# EAGLE design Power only (EAGLE 8.6.3)
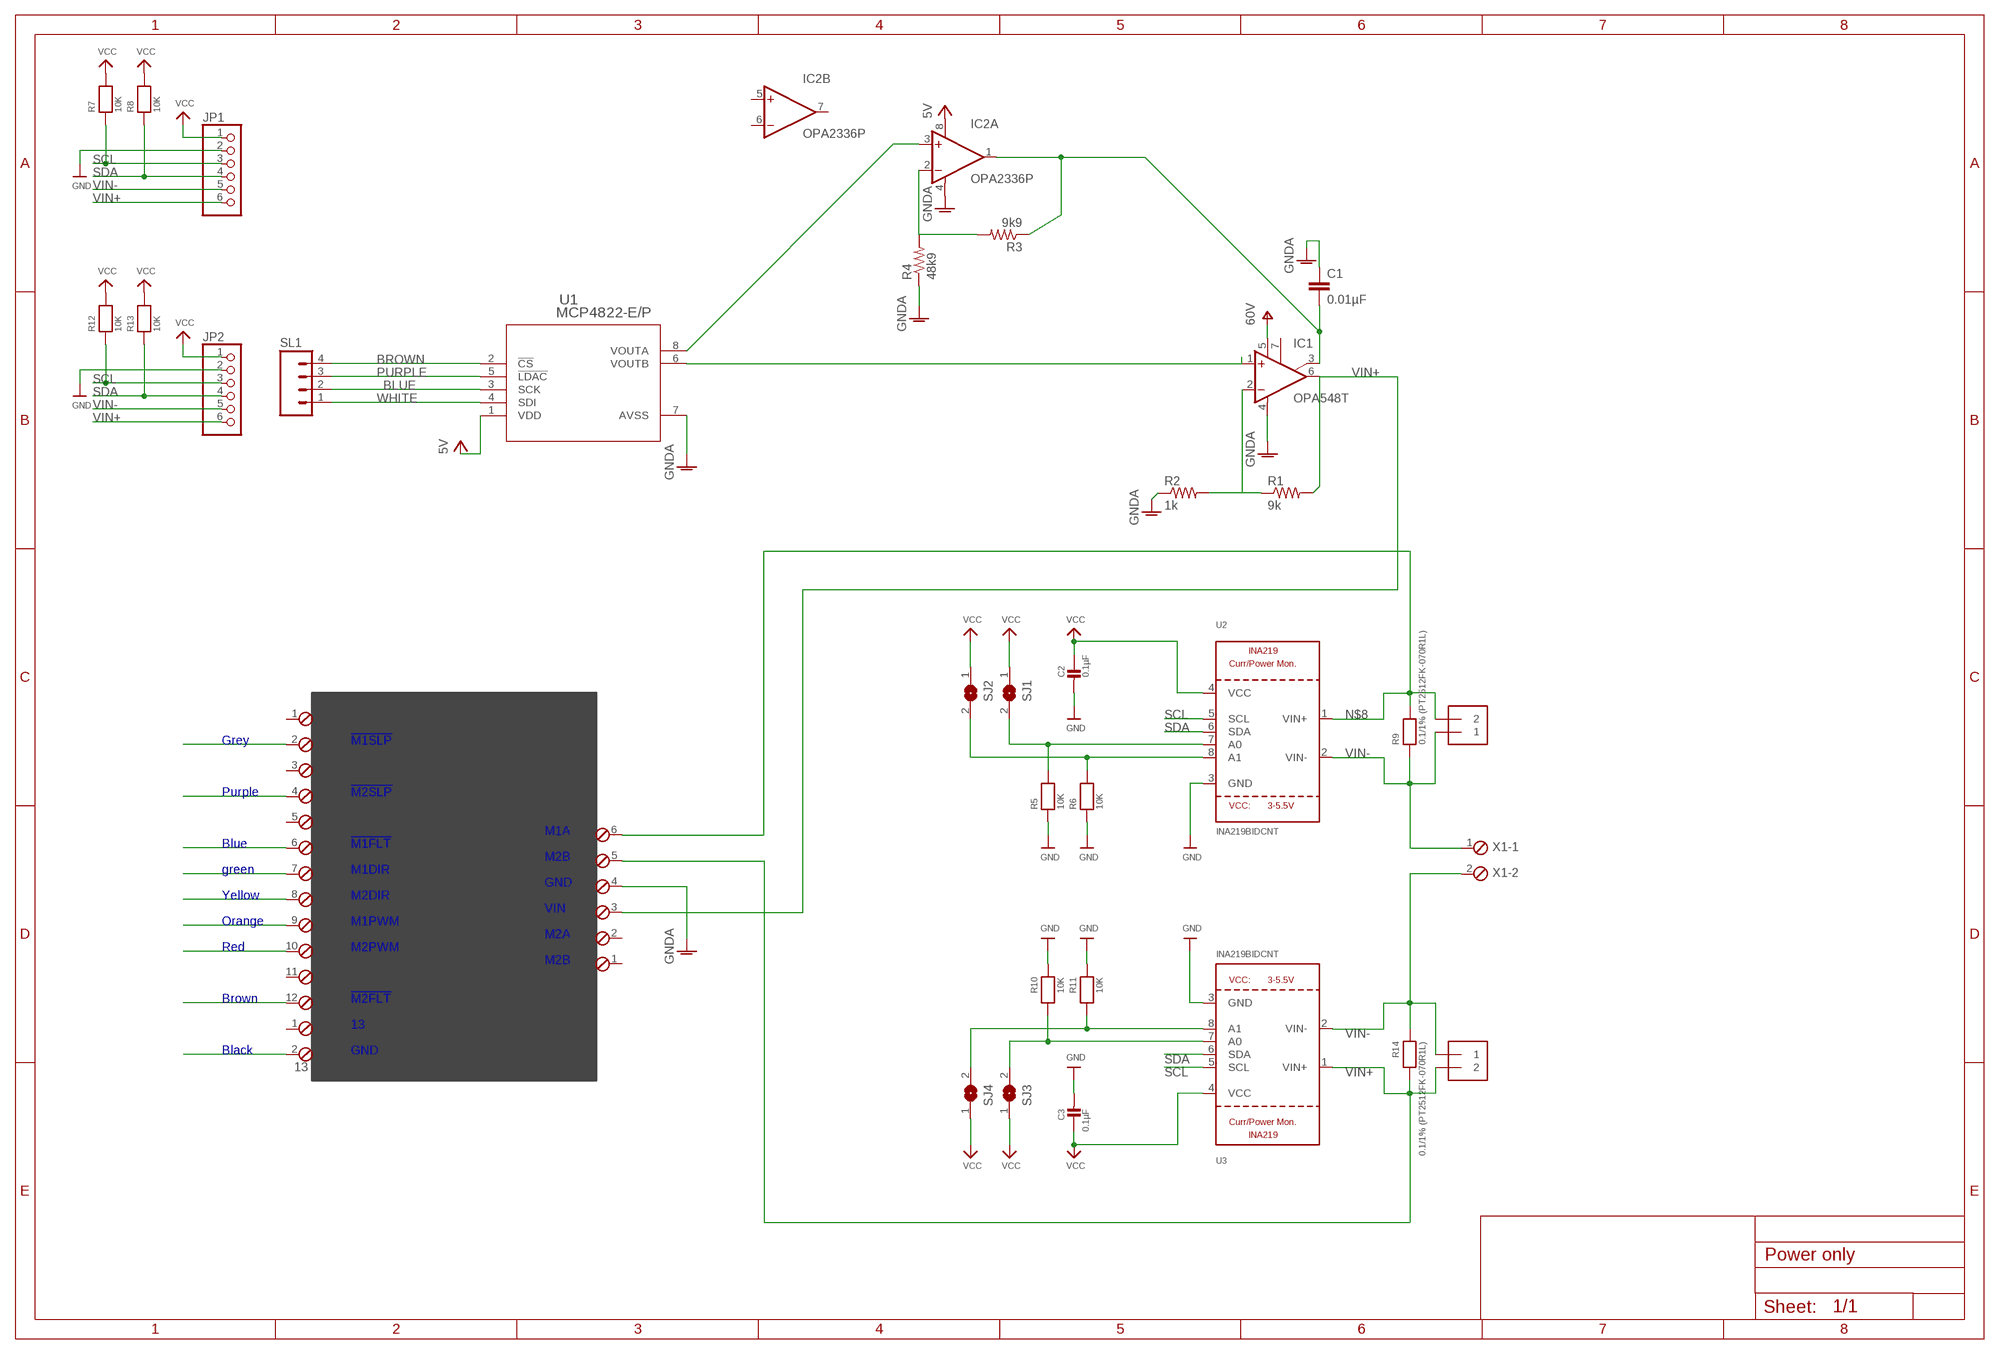
[diagram p0: schematic, sheet 1]

## Parts
C1  0.01µF  C5/3  [C5B3]
C2  0.1µF  CAP_CERAMIC0805  [0805]
C3  0.1µF  CAP_CERAMIC0805  [0805]
IC1  OPA548T  [TO220-7]
IC2  OPA2336P  [DIL08]
J1  TERMBLOCK_1X2-3.5MM  [1X2-3.5MM]
J2  TERMBLOCK_1X2-3.5MM  [1X2-3.5MM]
JP1  HEADER-1X670MIL  [1X06_ROUND_70]
JP2  HEADER-1X670MIL  [1X06_ROUND_70]
R1  9k  R-US_0207/7  [0207/7]
R2  1k  R-US_0207/7  [0207/7]
R3  9k9  R-US_0207/7  [0207/7]
R4  48k9  R-US_0207/7  [0207/7]
R5  10K  RESISTOR0805  [0805]
R6  10K  RESISTOR0805  [0805]
R7  10K  RESISTOR0805  [0805]
R8  10K  RESISTOR0805  [0805]
R9  0.1/1% (PT2512FK-070R1L)  RESISTOR2512  [2512]
R10  10K  RESISTOR0805  [0805]
R11  10K  RESISTOR0805  [0805]
R12  10K  RESISTOR0805  [0805]
R13  10K  RESISTOR0805  [0805]
R14  0.1/1% (PT2512FK-070R1L)  RESISTOR2512  [2512]
SJ1  SOLDERJUMPERREFLOW_NOPASTE  [SOLDERJUMPER_REFLOW_NOPASTE]
SJ2  SOLDERJUMPERREFLOW_NOPASTE  [SOLDERJUMPER_REFLOW_NOPASTE]
SJ3  SOLDERJUMPERREFLOW_NOPASTE  [SOLDERJUMPER_REFLOW_NOPASTE]
SJ4  SOLDERJUMPERREFLOW_NOPASTE  [SOLDERJUMPER_REFLOW_NOPASTE]
SL1  M04  [04P]
U1  MCP4822-E/P  [PDIP8_300MC]
U2  INA219BIDCNT  INA219  [SOT23-8]
U3  INA219BIDCNT  INA219  [SOT23-8]
X1  MPT2  [2POL254]
X2  MPT12  [12POL254]
X3  13  MPT2  [2POL254]
X4  MPT6  [6POL254]

## Nets
BLUE: SL1.2 U1.3(SCK)
BROWN: SL1.4 U1.2(!CS)
GND: C2.2 C3.2 JP1.2 JP2.2 R5.1 R6.1 R10.1 R11.1 U2.3(GND) U3.3(GND)
GNDA: C1.1 IC1.4(V-) IC2.4(A:V-) R2.1 R4.1 U1.7(AVSS) X4.4
N$1: U1.6(VOUTB)
N$2: C1.2 IC1.3(ILIM) IC2.1(A:OUT) R3.1
N$3: IC2.3(A:+IN) U1.8(VOUTA)
N$4: IC1.2(-IN) R1.1 R2.2
N$5: R6.2 SJ2.2 U2.8(A1)
N$6: IC2.2(A:-IN) R3.2 R4.2
N$7: R5.2 SJ1.2 U2.7(A0)
N$8: J1.2 R9.2 U2.1(VIN+) X4.6
N$9: R11.2 SJ4.2 U3.8(A1)
N$10: R10.2 SJ3.2 U3.7(A0)
N$11: X2.2
N$13: X2.4
N$15: X2.6
N$16: X2.7
N$17: X2.8
N$18: X2.9
N$19: X2.10
N$21: X2.12
N$22: X3.2
PURPLE: SL1.3 U1.5(!LDAC)
SCL: JP1.3 JP2.3 R7.1 R12.1 U2.5(SCL) U3.5(SCL)
SDA: JP1.4 JP2.4 R8.1 R13.1 U2.6(SDA) U3.6(SDA)
V+: IC1.5(V+) ; supply symbol labelled 60V
VCC: C2.1 C3.1 IC2.8(A:V+) JP1.1 JP2.1 R7.2 R8.2 R12.2 R13.2 SJ1.1 SJ2.1 SJ3.1 SJ4.1 U1.1(VDD) U2.4(VCC) U3.4(VCC) ; supply symbol labelled 5V
VIN+: IC1.6(OUT) J2.2 JP1.6 JP2.6 R1.2 R14.2 U3.1(VIN+) X4.3 X4.5
VIN-: J1.1 J2.1 JP1.5 JP2.5 R9.1 R14.1 U2.2(VIN-) U3.2(VIN-) X1.1 X1.2
WHITE: SL1.1 U1.4(SDI)
Unconnected: IC1.1(+IN) IC1.7(E/S) IC2.5(B:+IN) IC2.6(B:-IN) IC2.7(B:OUT) X2.1 X2.3 X2.5 X2.11 X3.1 X4.1 X4.2

## Notes on the sheet
- Grey | !M1SLP
- Purple | !M2SLP
- M1A
- Blue | !M1FLT
- M2B
- green | M1DIR
- GND
- Yellow | M2DIR
- VIN
- Orange | M1PWM
- M2A
- Red | M2PWM
- M2B
- Brown | !M2FLT
- 13
- Black | GND

## Library data of the parts
C1 = capacitor-wima:C: CAPACITOR naming: grid - package width
C2 C3 = microbuilder:CAP_CERAMIC: Ceramic Capacitors For new designs, use the packages preceded by an '_' character since they are more reliable: The following footprints should be used on most boards: _0402 - Standard footprint for regular board layouts _0603 - Standard footprint for regular board layouts _0805 - Standard footprint for regular board layouts For extremely tight-pitch boards where space is at a premium, the following 'micro-pitch' footprints can be used (smaller pads, no silkscreen outline, etc.): _0402MP - Micro-pitch footprint for very dense/compact boards _0603MP - Micro-pitch footprint for very dense/compact boards _0805MP - Micro-pitch footprint for very dense/compact boards Commonly Stocked Parts 0402 - 0402 Surface Mount Capacitors 16pF 50V 5% [Digikey: 445-4899-2-ND] 18pF 50V 5% [Digikey: 490-1281-2-ND] 22pF 50V 5% [Digikey: 490-1283-2-ND] 68pF 50V 5% [Digikey: 490-1289-2-ND] 0.1uF 10V 10% [Digikey: 490-1318-2-ND] 1.0uF 6.3V 10% [Digikey: 490-1320-2-ND] 0603 - 0603 Surface Mount Capacitors 16 pF 50V 5% [Digikey: 445-5051-2-ND] 22 pF 50V [Digikey: PCC220ACVTR-ND] 33 pF 50V 5% [Digikey: 490-1415-1-ND] 56pF 50V 5% [Digikey: 490-1421-1-ND] 220pF 50V 5% [Digikey: 445-1285-1-ND] 680 pF 50V 2200 pF 50V 5% C0G [Digikey: 445-1297-1-ND] 5600 pF 100V 5% X7R [Digikey: 478-3711-1-ND] 0.1 µF 25V 10% [Digikey: PCC2277TR-ND] 0.22 µF 16V 10% X7R [Digikey: 445-1318-1-ND] 1.0 µF 25V 10% [Digikey: 445-5146-2-ND] 0603 - RF Specific 3pF 250V +/-0.1pF RF [Digikey: 712-1347-1-ND] 18 pF 250V 5% [Digikey: 478-3505-1-ND or 712-1322-1-ND] 56 pF 250V 5% C0G RF [Digikey: 490-4867-1-ND] 68 pF 250V RF [Digikey: 490-4868-1-ND] 0805 - 0805 Surface Mount Capacitors 220 pF 250V 2% RF Ceramic Capacitor [Digikey: 712-1398-1-ND] 1000 pF 50V 2% NP0 Ceramic Capacitor [Digikey: 478-3760-1-ND] 0.1 µF 25V 10% Ceramic Capacitor [Digikey: PCC1828TR-ND] 1.0 µF 16V 10% Ceramic Capacitor[Digikey: 490-1691-2-ND] 10.0 µF 10V 10% Ceramic Capacitor[Digikey: 709-1228-1-ND] 10.0 uF 16V 10% Ceramic Capacitor [Digikey: 478-5165-2-ND] 47 uF 6.3V 20% Ceramic Capacitor [Digikey: 587-1779-1-ND or 399-5506-1-ND] 1206 - 1206 Surface Mount Capacitors 47uF 10V 20% Ceramic Capacitor [Digikey: 490-5528-1-ND or 399-5508-1-ND or 445-6010-1-ND] 100uF 6.3V -20%, +80% Y5V Ceramic Capacitor (Digikey: 490-4512-1-ND, Mouser: 81-GRM31CF50J107ZE1L)
IC1 = burr-brown:OPA548: Operational Amplifier High-Voltage, High-Current; MF: TEXAS INSTRUMENTS; MPN: OPA548T; OC_FARNELL: 1564885; OC_NEWARK: 69K2680
IC2 = burr-brown:OPA2336: Single-Supply, MicroPower CMOS Operational Amplifiers MicroAmplifier Series; Product Folder:OPA2336,; MPN: OPA2336PA.; OC_FARNELL: 1097396; OC_NEWARK: 26M1908
J1 J2 = microbuilder:TERMBLOCK_1X2: 3.5mm Terminal block http://www.ladyada.net/library/pcb/eaglelibrary.html
JP1 JP2 = microbuilder:HEADER-1X6: PIN HEADER
R1-R4 = rcl:R-US_: RESISTOR, American symbol; SPICEPREFIX: R
R5-R14 = microbuilder:RESISTOR: Resistors For new designs, use the packages preceded by an '_' character since they are more reliable: The following footprints should be used on most boards: _0402 - Standard footprint for regular board layouts _0603 - Standard footprint for regular board layouts _0805 - Standard footprint for regular board layouts For extremely tight-pitch boards where space is at a premium, the following 'micro-pitch' footprints can be used (smaller pads, no silkscreen outline, etc.): _0402MP - Micro-pitch footprint for very dense/compact boards _0603MP - Micro-pitch footprint for very dense/compact boards _0805MP - Micro-pitch footprint for very dense/compact boards
SJ1-SJ4 = microbuilder:SOLDERJUMPER: SMD Solder JUMPER Solder the two pads together to create a connection, or remove the solder to break it. REFLOW - Use this footprint for solder paste and reflow ovens. WAVE - Use this footprint for hand-soldering (larger pads). CLOSED - Has a trace between the two pads to ensure it is closed by default. The trace needs to be cut to disable the jumper, and can be closed again by creating a solder bridge between the two pads.
SL1 = con-amp-quick:M04: AMP QUICK CONNECTOR; OC_FARNELL: unknown; OC_NEWARK: unknown
U1 = MCP48xx:MCP4822-E/P; MANUFACTURER_PART_NUMBER: MCP4822EP; VENDOR: Microchip
U2 U3 = microbuilder:INA219: INA219 - I2C Current/Power Monitor Voltage Range: 0-26V Accuracy: 0.5% Temperature: -40°C - 125°C
X1 X3 = con-phoenix-254:MPT2: PHOENIX CONNECTOR; OC_FARNELL: unknown; OC_NEWARK: unknown
X2 = con-phoenix-254:MPT12: PHOENIX CONNECTOR; OC_FARNELL: unknown; OC_NEWARK: unknown
X4 = con-phoenix-254:MPT6: PHOENIX CONNECTOR; OC_FARNELL: unknown; OC_NEWARK: unknown

## Board
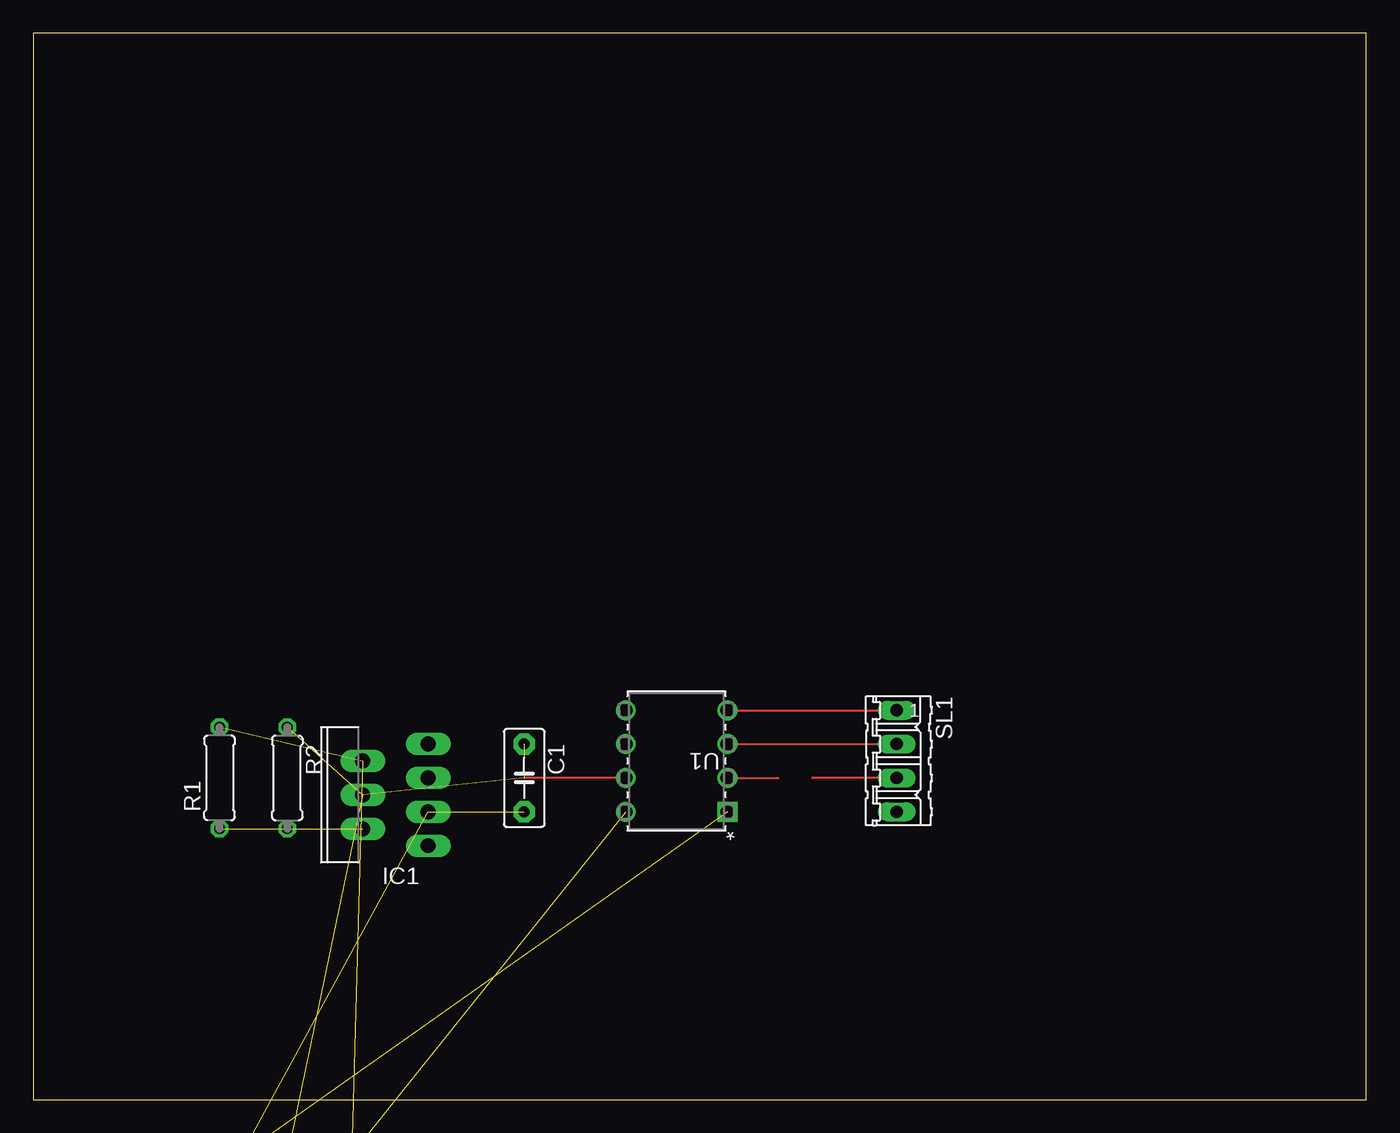
[diagram p1: board, top side]
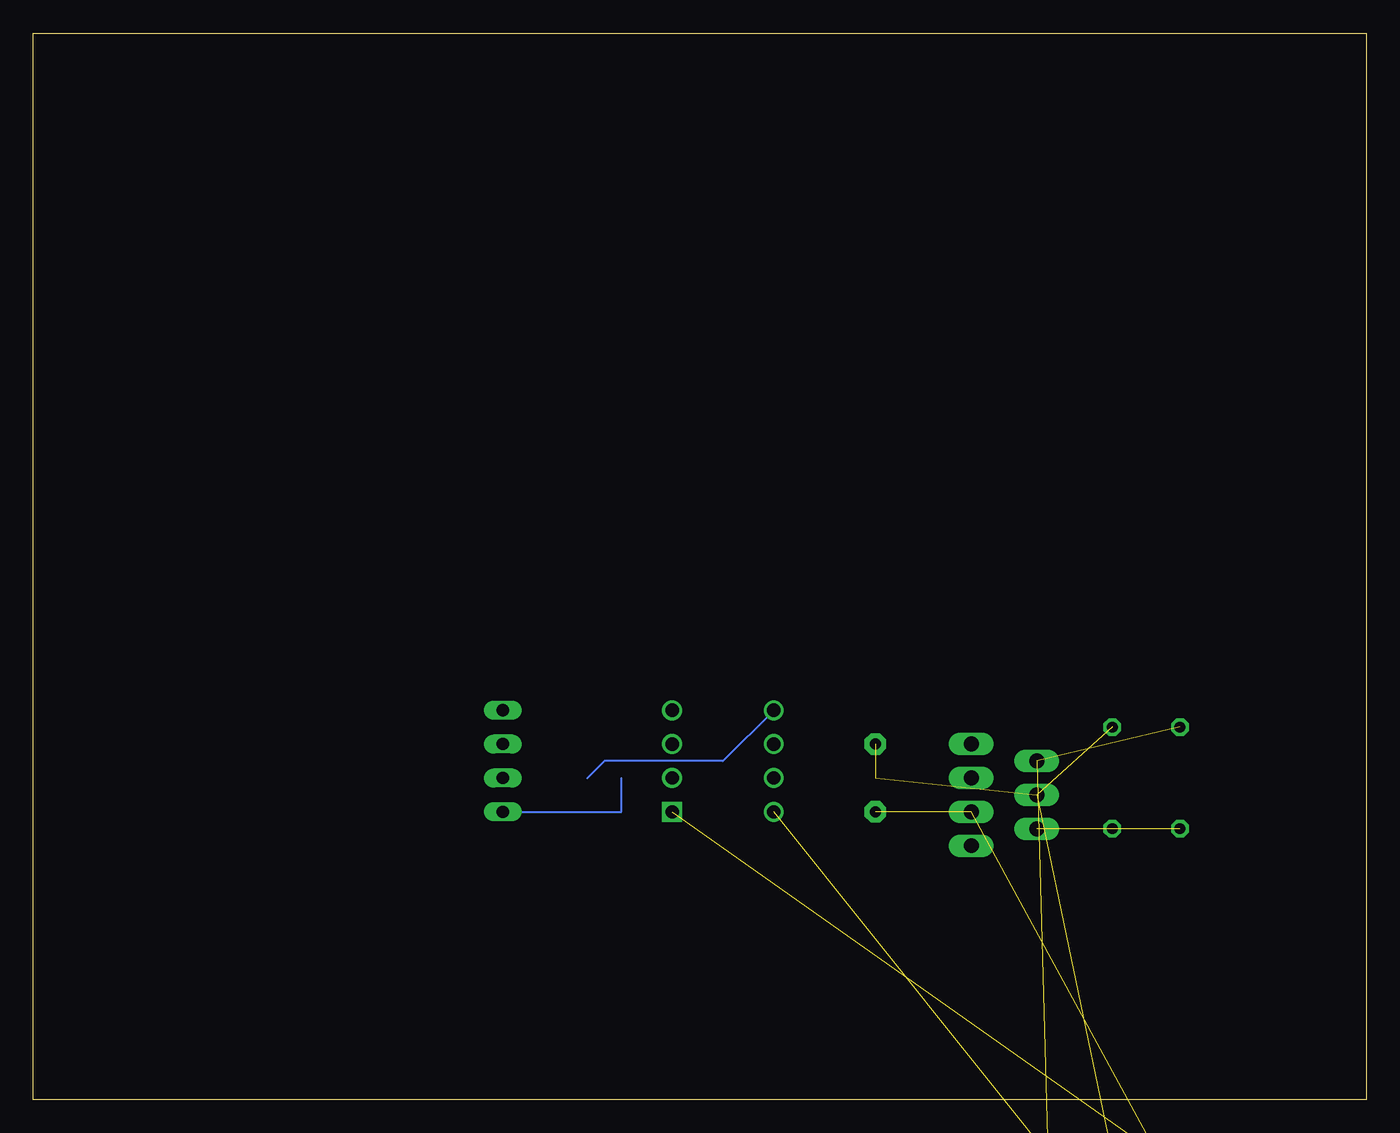
[diagram p2: board, bottom side, seen from below]

Size 100 x 80 mm. Coordinates in mm from the lower left corner, seen from the top.
Outline: 0,0 100,0 100,80 0,80 0,0
Copper layers (1*16): Top 0.035mm / dielectric 1.5mm / Bottom 0.035mm
Design rules "default": minimum track width 6mil, minimum drill 0.35mm, track to track 6mil, track to pad 6mil, pad to pad 6mil, via to via 6mil, smd to smd 6mil, copper to edge 40mil, drill to drill 6mil, minimum pad ring 10mil, minimum via ring 8mil, stop-mask expansion 4mil, vias tented up to drill 0mil, thermal gap 10mil

### Footprints (pad centres in the part's own frame; a part is rotated, then mirrored left to right if it is on the bottom)
C5B3 = drill 0.813 pad 1.6 octagon: 1 -2.54,0; 2 2.54,0
0805 = smd 1.3 x 1.5: 1 -0.95,0; 2 0.95,0
TO220-7 = drill 1.118 pad 1.626 long: 1 -3.81,-8.036; 2 -2.54,-3.126; 3 -1.27,-8.036; 4 0,-3.126; 5 1.27,-8.036; 6 2.54,-3.126; 7 3.81,-8.036
DIL08 = drill 0.813 pad 1.6 octagon: 1 -3.81,-3.81; 2 -1.27,-3.81; 3 1.27,-3.81; 4 3.81,-3.81; 5 3.81,3.81; 6 1.27,3.81; 7 -1.27,3.81; 8 -3.81,3.81
1X2-3.5MM = drill 1 pad 2.184: 1 1.8,0; 2 -1.7,0
1X06_ROUND_70 = drill 1 pad 1.778: 1 -6.35,0; 2 -3.81,0; 3 -1.27,0; 4 1.27,0; 5 3.81,0; 6 6.35,0
0207/7 = drill 0.813 octagon: 1 -3.81,0; 2 3.81,0
2512 = smd 1.8 x 3.2: 1 -2.8,0; 2 2.8,0
SOLDERJUMPER_REFLOW_NOPASTE = smd 1.168 x 1.6: 1 -0.762,0; 2 0.762,0
04P = drill 0.914 long: 1 -3.81,0; 2 -1.27,0; 3 1.27,0; 4 3.81,0
PDIP8_300MC = drill 0.991 pad 1.499 square: 1 -7.62,7.62 | drill 0.991 pad 1.499: 2 -7.62,5.08; 3 -7.62,2.54; 4 -7.62,0; 5 0,0; 6 0,2.54; 7 0,5.08; 8 0,7.62
SOT23-8 = smd 0.4 x 1.2: 1 -0.975,-1.3; 2 -0.325,-1.3; 3 0.325,-1.3; 4 0.975,-1.3; 5 0.975,1.3; 6 0.325,1.3; 7 -0.325,1.3; 8 -0.975,1.3
2POL254 = drill 1.2 long: 1 -1.27,0; 2 1.27,0
12POL254 = drill 1.2 long: 1 -13.97,0; 2 -11.43,0; 3 -8.89,0; 4 -6.35,0; 5 -3.81,0; 6 -1.27,0; 7 1.27,0; 8 3.81,0; 9 6.35,0; 10 8.89,0; 11 11.43,0; 12 13.97,0
6POL254 = drill 1.2 pad 1.778 long: 1 -6.35,0; 2 -3.81,0; 3 -1.27,0; 4 1.27,0; 5 3.81,0; 6 6.35,0

### Placement (x,y rotation side)
C1  36.83,24.13 270 top
C2  27.94,-99.06 0 top  (outside the outline)
C3  17.78,-180.34 0 top  (outside the outline)
IC1  21.59,22.86 90 top
IC2  12.7,-12.7 0 top  (outside the outline)
J1  12.7,-66.04 0 top  (outside the outline)
J2  12.7,-139.7 0 top  (outside the outline)
JP1  15.24,-86.36 0 top  (outside the outline)
JP2  15.24,-160.02 0 top  (outside the outline)
R1  13.97,24.13 90 top
R2  19.05,24.13 270 top
R3  12.7,-33.02 0 top  (outside the outline)
R4  12.7,-48.26 0 top  (outside the outline)
R5  35.56,-99.06 0 top  (outside the outline)
R6  2.54,-106.68 0 top  (outside the outline)
R7  10.16,-106.68 0 top  (outside the outline)
R8  17.78,-106.68 0 top  (outside the outline)
R9  35.56,-83.82 0 top  (outside the outline)
R10  27.94,-172.72 0 top  (outside the outline)
R11  10.16,-180.34 0 top  (outside the outline)
R12  35.56,-172.72 0 top  (outside the outline)
R13  2.54,-180.34 0 top  (outside the outline)
R14  35.56,-157.48 0 top  (outside the outline)
SJ1  17.78,-99.06 0 top  (outside the outline)
SJ2  22.86,-99.06 0 top  (outside the outline)
SJ3  17.78,-172.72 0 top  (outside the outline)
SJ4  22.86,-172.72 0 top  (outside the outline)
SL1  64.77,25.4 270 top
U1  44.45,29.21 180 top
U2  2.54,-99.06 0 top  (outside the outline)
U3  2.54,-172.72 0 top  (outside the outline)
X1  12.7,-119.38 0 top  (outside the outline)
X2  25.4,-193.04 0 top  (outside the outline)
X3  12.7,-213.36 0 top  (outside the outline)
X4  17.78,-233.68 0 top  (outside the outline)

### Tracks (layer width: path | path; a pad name or v marks a point on that pad's centre or on a via)
BLUE
  Top 0.152: U1.3 SL1.2
BROWN  (1 unrouted)
  Top 0.152: U1.2 55.88,24.13
  Bottom 0.152: SL1.4 55.88,21.59 55.88,24.13
GND  (9 unrouted)
GNDA  (6 unrouted)
  Top 0.152: U1.7 36.83,24.13
N$2  (3 unrouted)
N$3  (1 unrouted)
N$4  (2 unrouted)
N$5  (2 unrouted)
N$6  (2 unrouted)
N$7  (2 unrouted)
N$8  (3 unrouted)
N$9  (2 unrouted)
N$10  (2 unrouted)
PURPLE  (1 unrouted)
  Top 0.152: SL1.3 58.42,24.13
  Bottom 0.152: U1.5 48.26,25.4 57.15,25.4 58.42,24.13
SCL  (5 unrouted)
SDA  (5 unrouted)
VCC  (15 unrouted)
VIN+  (8 unrouted)
VIN-  (9 unrouted)
WHITE
  Top 0.152: U1.4 SL1.1